# EAGLE design flatsat-breakout-main (EAGLE 9.3.2)
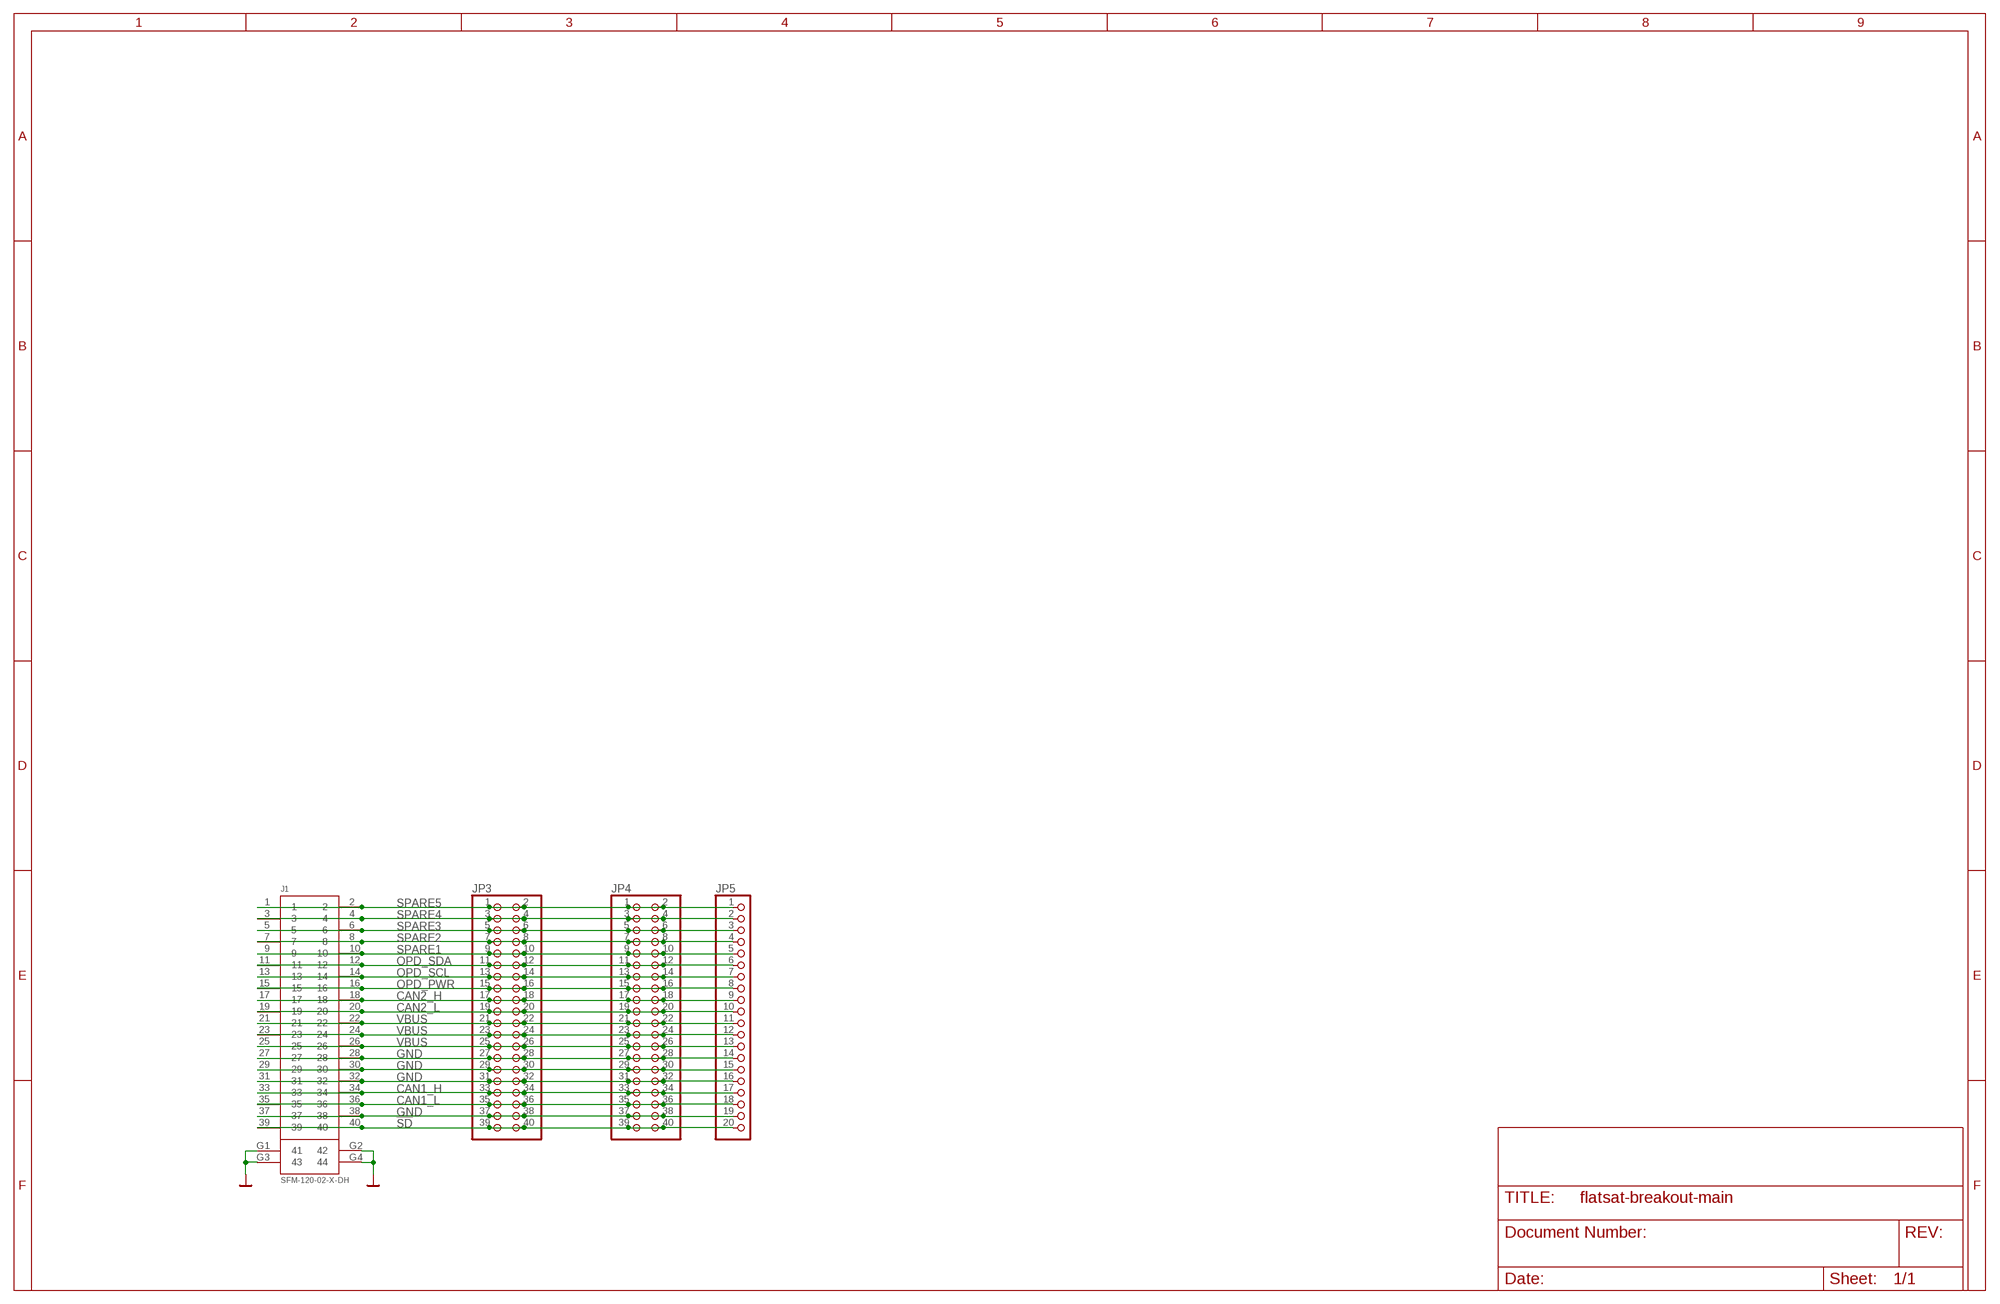
[diagram p0: schematic, sheet 1]

## Parts
J1  SFM-120-02-X-DH  [SFM-120-02-X-DH]
JP3  PINHD-2X20  [2X20]
JP4  PINHD-2X20  [2X20]
JP5  PINHD-1X20  [1X20]

## Nets
!SD: J1.39 J1.40 JP3.39 JP3.40 JP4.39 JP4.40 JP5.20
CAN1_H: J1.33 J1.34 JP3.33 JP3.34 JP4.33 JP4.34 JP5.17
CAN1_L: J1.35 J1.36 JP3.35 JP3.36 JP4.35 JP4.36 JP5.18
CAN2_H: J1.17 J1.18 JP3.17 JP3.18 JP4.17 JP4.18 JP5.9
CAN2_L: J1.19 J1.20 JP3.19 JP3.20 JP4.19 JP4.20 JP5.10
GND: J1.27 J1.28 J1.29 J1.30 J1.31 J1.32 J1.37 J1.38 J1.G1 J1.G2 J1.G3 J1.G4 JP3.27 JP3.28 JP3.29 JP3.30 JP3.31 JP3.32 JP3.37 JP3.38 JP4.27 JP4.28 JP4.29 JP4.30 JP4.31 JP4.32 JP4.37 JP4.38 JP5.14 JP5.15 JP5.16 JP5.19
OPD_PWR: J1.15 J1.16 JP3.15 JP3.16 JP4.15 JP4.16 JP5.8
OPD_SCL: J1.13 J1.14 JP3.13 JP3.14 JP4.13 JP4.14 JP5.7
OPD_SDA: J1.11 J1.12 JP3.11 JP3.12 JP4.11 JP4.12 JP5.6
SPARE1: J1.9 J1.10 JP3.9 JP3.10 JP4.9 JP4.10 JP5.5
SPARE2: J1.7 J1.8 JP3.7 JP3.8 JP4.7 JP4.8 JP5.4
SPARE3: J1.5 J1.6 JP3.5 JP3.6 JP4.5 JP4.6 JP5.3
SPARE4: J1.3 J1.4 JP3.3 JP3.4 JP4.3 JP4.4 JP5.2
SPARE5: J1.1 J1.2 JP3.1 JP3.2 JP4.1 JP4.2 JP5.1
VBUS: J1.21 J1.22 J1.23 J1.24 J1.25 J1.26 JP3.21 JP3.22 JP3.23 JP3.24 JP3.25 JP3.26 JP4.21 JP4.22 JP4.23 JP4.24 JP4.25 JP4.26 JP5.11 JP5.12 JP5.13

## Library data of the parts
J1 = J-Samtec-SFM-120-02-X-DH:SFM-120-02-X-DH: 0.050"X0.050" SOCKET STRIP ASSEMBLY.
JP3 JP4 = pinhead:PINHD-2X20: PIN HEADER
JP5 = pinhead:PINHD-1X20: PIN HEADER

## Board
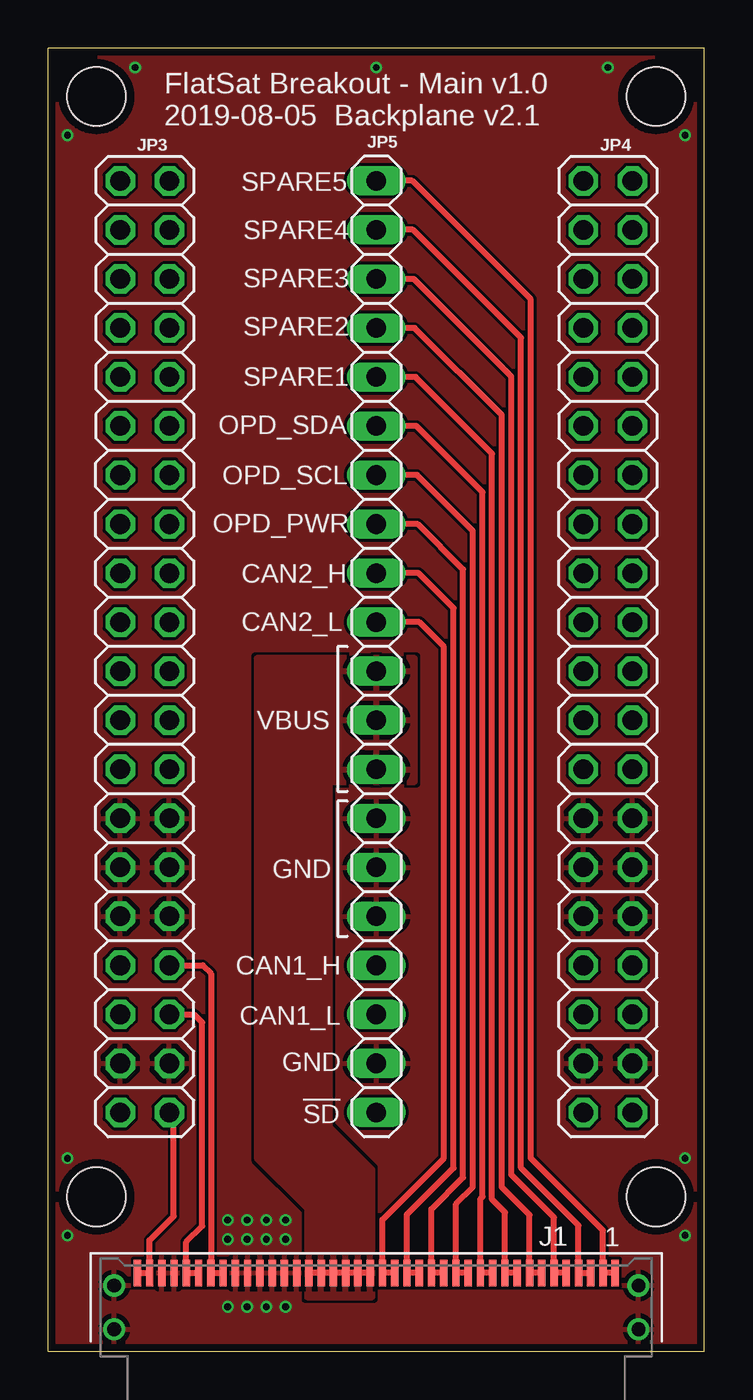
[diagram p1: board, top side]
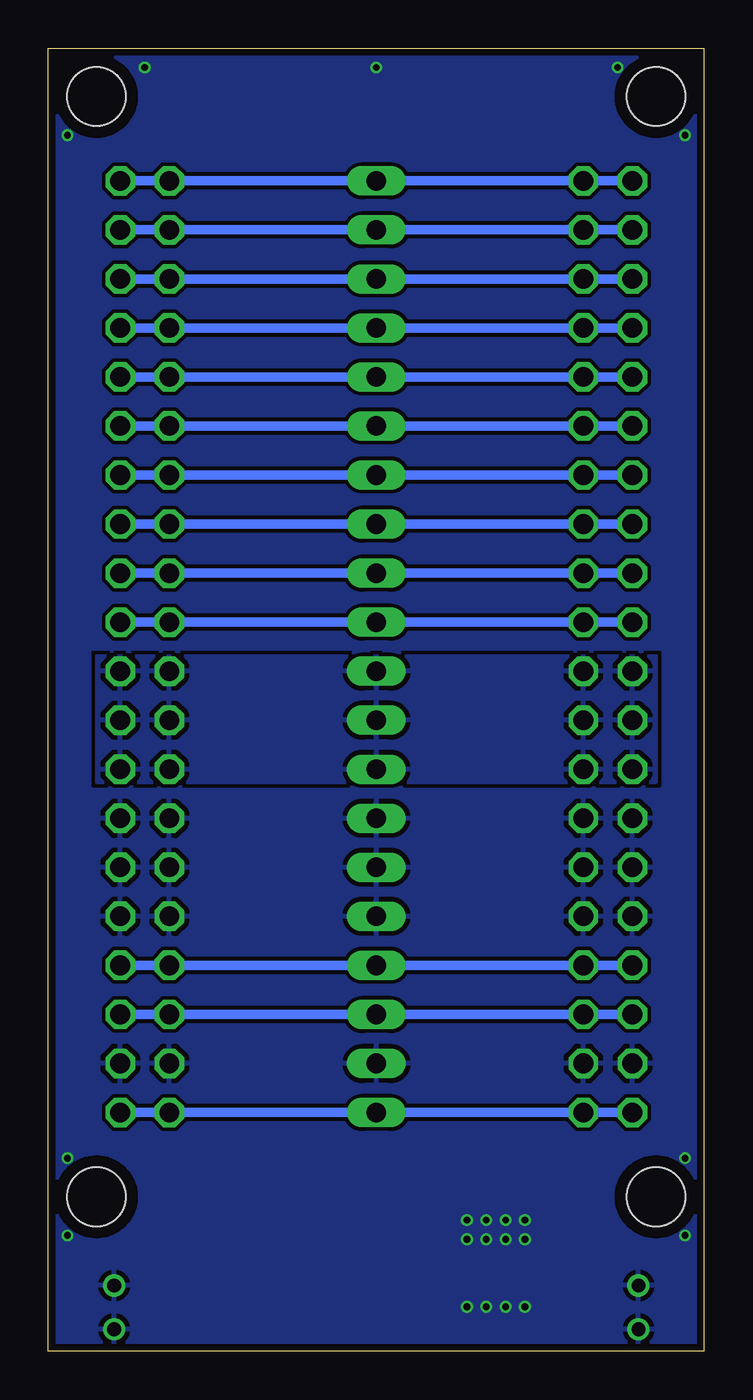
[diagram p2: board, bottom side, seen from below]

Size 34 x 67.5 mm. Coordinates in mm from the lower left corner, seen from the top.
Outline: 0,0 34,0 34,67.5 0,67.5 0,0
Copper layers (1*16): Top 0.035559375mm / dielectric 1.6mm / Bottom 0.035559375mm
Design rules "oshpark-2layer-tented": minimum track width 6mil, minimum drill 10mil, track to track 6mil, track to pad 6mil, pad to pad 6mil, via to via 6mil, smd to smd 6mil, copper to edge 15mil, drill to drill 6mil, minimum pad ring 5mil, minimum via ring 5mil, stop-mask expansion 2.5mil, vias tented up to drill 20mil, thermal gap 10mil

### Footprints (pad centres in the part's own frame; a part is rotated, then mirrored left to right if it is on the bottom)
STAND-OFF-TIGHT = hole 3.048: 0,0
SFM-120-02-X-DH = smd 0.381 x 1.397: 1 -12.383,-4.051; 2 -11.748,-4.051; 3 -11.113,-4.051; 4 -10.477,-4.051; 5 -9.842,-4.051; 6 -9.207,-4.051; 7 -8.572,-4.051; 8 -7.938,-4.051; 9 -7.303,-4.051; 10 -6.668,-4.051; 11 -6.032,-4.051; 12 -5.397,-4.051; 13 -4.763,-4.051; 14 -4.128,-4.051; 15 -3.493,-4.051; 16 -2.857,-4.051; 17 -2.223,-4.051; 18 -1.587,-4.051; 19 -0.953,-4.051; 20 -0.318,-4.051; 21 0.318,-4.051; 22 0.953,-4.051; 23 1.587,-4.051; 24 2.223,-4.051; 25 2.857,-4.051; 26 3.493,-4.051; 27 4.128,-4.051; 28 4.763,-4.051; 29 5.397,-4.051; 30 6.032,-4.051; 31 6.668,-4.051; 32 7.303,-4.051; 33 7.938,-4.051; 34 8.572,-4.051; 35 9.207,-4.051; 36 9.842,-4.051; 37 10.477,-4.051; 38 11.113,-4.051; 39 11.748,-4.051; 40 12.383,-4.051 | drill 0.711 pad 1.143: G1 -13.589,-1.143; G2 13.589,-1.143; G3 -13.589,-3.404; G4 13.589,-3.404
2X20 = drill 1.016 octagon: 1 -24.13,-1.27; 2 -24.13,1.27; 3 -21.59,-1.27; 4 -21.59,1.27; 5 -19.05,-1.27; 6 -19.05,1.27; 7 -16.51,-1.27; 8 -16.51,1.27; 9 -13.97,-1.27; 10 -13.97,1.27; 11 -11.43,-1.27; 12 -11.43,1.27; 13 -8.89,-1.27; 14 -8.89,1.27; 15 -6.35,-1.27; 16 -6.35,1.27; 17 -3.81,-1.27; 18 -3.81,1.27; 19 -1.27,-1.27; 20 -1.27,1.27; 21 1.27,-1.27; 22 1.27,1.27; 23 3.81,-1.27; 24 3.81,1.27; 25 6.35,-1.27; 26 6.35,1.27; 27 8.89,-1.27; 28 8.89,1.27; 29 11.43,-1.27; 30 11.43,1.27; 31 13.97,-1.27; 32 13.97,1.27; 33 16.51,-1.27; 34 16.51,1.27; 35 19.05,-1.27; 36 19.05,1.27; 37 21.59,-1.27; 38 21.59,1.27; 39 24.13,-1.27; 40 24.13,1.27
1X20 = drill 1.016 long: 1 -24.13,0; 2 -21.59,0; 3 -19.05,0; 4 -16.51,0; 5 -13.97,0; 6 -11.43,0; 7 -8.89,0; 8 -6.35,0; 9 -3.81,0; 10 -1.27,0; 11 1.27,0; 12 3.81,0; 13 6.35,0; 14 8.89,0; 15 11.43,0; 16 13.97,0; 17 16.51,0; 18 19.05,0; 19 21.59,0; 20 24.13,0

### Placement (x,y rotation side)
H1  STAND-OFFTIGHT  [STAND-OFF-TIGHT]  31.5,8 0 top
H3  STAND-OFFTIGHT  [STAND-OFF-TIGHT]  2.5,8 0 top
H4  STAND-OFFTIGHT  [STAND-OFF-TIGHT]  2.5,65 0 top
H5  STAND-OFFTIGHT  [STAND-OFF-TIGHT]  31.5,65 0 top
J1  17,0 180 top
JP3  5,36.5 270 top
JP4  29,36.5 270 top
JP5  17,36.5 270 top

### Tracks (layer width: path | path; a pad name or v marks a point on that pad's centre or on a via)
!SD
  Top 0.3: J1.40 J1.39 5.25,5.75 6.5,7 6.5,12.14 JP3.40
  Bottom 0.3: JP5.20 JP3.40
  Bottom 0.5: JP3.39 JP3.40 JP4.39 JP4.40
CAN1_H
  Top 0.3: J1.33 J1.34 8.43,19.57 8.01,19.99 JP3.34
  Bottom 0.3: JP5.17 JP3.34
  Bottom 0.5: JP3.33 JP3.34 JP4.33 JP4.34
CAN1_L
  Top 0.3: J1.35 J1.36 7.16,5.66 7.97,6.47 7.97,17.02 7.55,17.45 JP3.36
  Bottom 0.5: JP3.35 JP3.36 JP5.18 JP4.35 JP4.36
CAN2_H
  Top 0.3: J1.17 J1.18 18.59,7.09 21,9.5 21,38.5 19.19,40.31 JP5.9
  Bottom 0.5: JP3.17 JP3.18 JP5.9 JP4.17 JP4.18
CAN2_L
  Top 0.3: J1.19 J1.20 17.32,6.82 20.5,10 20.5,36.5 19.23,37.77 JP5.10
  Bottom 0.5: JP3.19 JP3.20 JP5.10 JP4.19 JP4.20
GND  (via drill 0.35)
  other vias: 10.3,5.8 11.3,5.8 12.3,5.8 12.3,6.8 11.3,6.8 10.3,6.8 9.3,5.8 29,66.5 33,63 4.5,66.5 1,63 1,10 1,6 33,6 33,10 9.3,6.8 12.3,2.3 11.3,2.3 10.3,2.3 9.3,2.3 17,66.5
  pour Top (rank 6): 0,0 0,67.5 34,67.5 34,0
  pour Bottom (isolate 0.2, rank 6): 34,0 34,67.5 0,67.5 0,0
OPD_PWR
  Top 0.3: J1.15 J1.16 19.86,7.36 21.5,9 21.5,40.5 19.15,42.85 JP5.8
  Bottom 0.5: JP3.15 JP3.16 JP5.8 JP4.15 JP4.16
OPD_SCL
  Top 0.3: J1.13 J1.14 21.13,7.63 22,8.5 22,42.5 19.11,45.39 JP5.7
  Bottom 0.5: JP3.13 JP3.14 JP5.7 JP4.13 JP4.14
OPD_SDA
  Top 0.3: J1.11 J1.12 22.4,7.9 22.5,8 22.5,44.5 19.07,47.93 JP5.6
  Bottom 0.5: JP3.11 JP3.12 JP5.6 JP4.11 JP4.12
SPARE1
  Top 0.3: J1.9 J1.10 23.67,7.19 23,7.86 23,46.5 19.03,50.47 JP5.5
  Bottom 0.5: JP3.9 JP3.10 JP5.5 JP4.9 JP4.10
SPARE2
  Top 0.3: J1.7 J1.8 24.94,7.06 23.5,8.5 23.5,48.5 18.99,53.01 JP5.4
  Bottom 0.5: JP3.7 JP3.8 JP5.4 JP4.7 JP4.8
SPARE3
  Top 0.3: J1.5 J1.6 26.21,6.93 24,9.14 24,50.5 18.95,55.55 JP5.3
  Bottom 0.5: JP3.5 JP3.6 JP5.3 JP4.5 JP4.6
SPARE4
  Top 0.3: J1.3 J1.4 27.48,6.52 24.5,9.5 24.5,52.5 18.91,58.09 JP5.2
  Bottom 0.5: JP3.3 JP3.4 JP5.2 JP4.3 JP4.4
SPARE5
  Top 0.3: J1.1 J1.2 28.75,6.25 25,10 25,54.5 18.87,60.63 JP5.1
  Bottom 0.5: JP3.1 JP3.2 JP5.1 JP4.1 JP4.2
VBUS
  Top 0.3: J1.26 J1.25 J1.24 J1.23 J1.22 J1.21
  pour Bottom (isolate 0.2): 2.5,36 31.5,36 31.5,29.5 2.5,29.5
  pour Top (isolate 0.2): 13.4,2.8 16.8,2.8 16.8,9.4 14.6,11.6 14.6,29.5 19,29.5 19,35.9 10.8,35.9 10.8,10 13.4,7.4

### Text on the board
tPlace: FlatSat Breakout - Main v1.0 / 2019-08-05 Backplane v2.1 | SPARE5 | SPARE4 | SPARE3 | SPARE2 | SPARE1 | OPD_SDA | OPD_SCL | OPD_PWR | CAN2_H | CAN2_L | VBUS | GND | CAN1_H | CAN1_L | GND | !SD
Reference: AUX connector here.